# Altium schematic sheet Input.SchDoc: INPUT
size A4
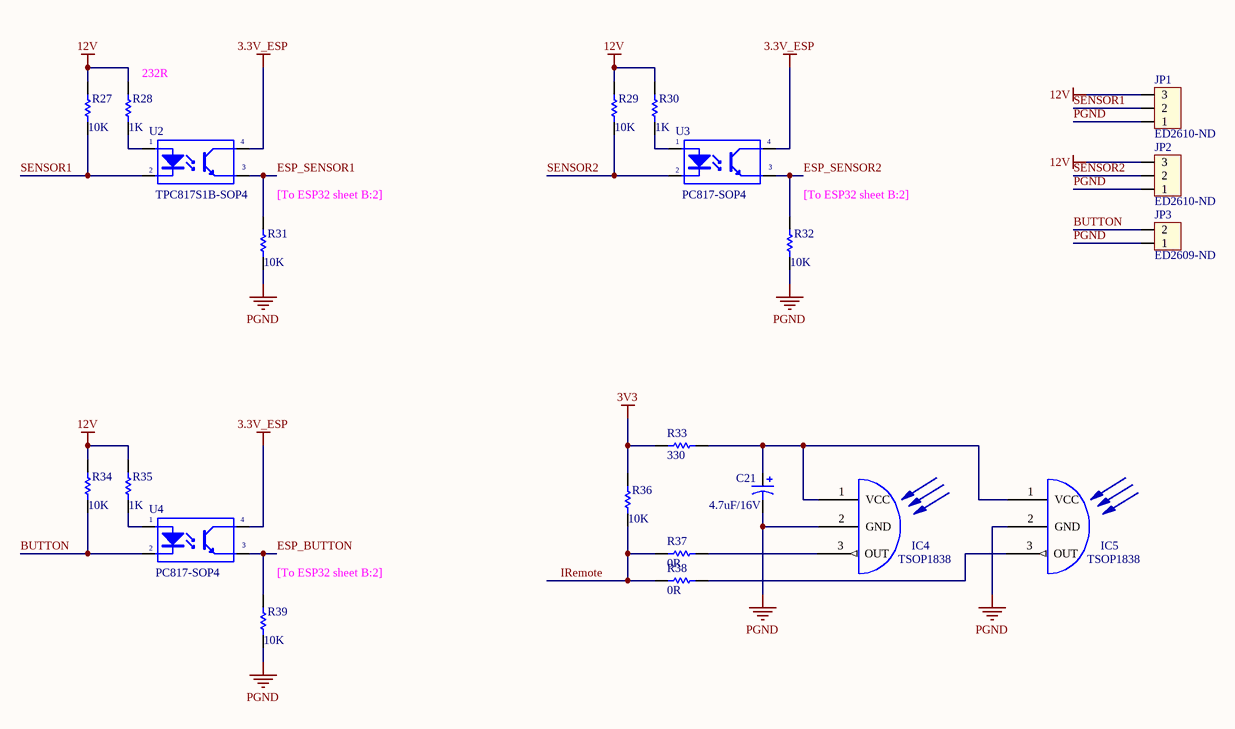
[diagram p0: Input.SchDoc]

## Parts
C21  value 4.7uF/16V  [C0805]  (hidden comment: Cap Pol1)
IC4  TSOP1838  [TSOP1838]
IC5  TSOP1838  [TSOP1838]
JP1  ED2610-ND  [DOMINO_OSTTC_3P]
JP2  ED2610-ND  [DOMINO_OSTTC_3P]
JP3  ED2609-ND  [DOMINO_OSTTC_2P]
R27  10K  [Res 0805 SMD]
R28  1K  [Res 0805 SMD]
R29  10K  [Res 0805 SMD]
R30  1K  [Res 0805 SMD]
R31  10K  [Res 0805 SMD]
R32  10K  [Res 0805 SMD]
R33  330  [Res 0805 SMD]
R34  10K  [Res 0805 SMD]
R35  1K  [Res 0805 SMD]
R36  10K  [Res 0805 SMD]
R37  0R  [Res 0805 SMD]
R38  0R  [Res 0805 SMD]
R39  10K  [Res 0805 SMD]
U2  TPC817S1B-SOP4  [TPC817-4SOP]
U3  PC817-SOP4  [TPC817-4SOP]
U4  PC817-SOP4  [TPC817-4SOP]

## Nets
3.3V_ESP: U2.4(C) U3.4(C) U4.4(C)
3V3: R33.2 R36.2
12V: JP1.3 JP2.3 R27.2 R28.2 R29.2 R30.2 R34.2 R35.2
PGND: C21.2 IC4.2(GND) IC5.2(GND) JP1.1 JP2.1 JP3.1 R31.1 R32.1 R39.1
BUTTON: JP3.2 R34.1 U4.2(K)
ESP_BUTTON: R39.2 U4.3(E)
ESP_SENSOR1: R31.2 U2.3(E)
ESP_SENSOR2: R32.2 U3.3(E)
IRemote: R36.1 R37.2 R38.2
SENSOR1: JP1.2 R27.1 U2.2(K)
SENSOR2: JP2.2 R29.1 U3.2(K)
NetC21_1: C21.1 IC4.1(VCC) IC5.1(VCC) R33.1
NetIC4_3: IC4.3(OUT) R37.1
NetIC5_3: IC5.3(OUT) R38.1
NetR28_1: R28.1 U2.1(A)
NetR30_1: R30.1 U3.1(A)
NetR35_1: R35.1 U4.1(A)

## Notes on the sheet
- (near R28) 232R
- [To ESP32 sheet B:2]
- Title
- Size:
- Date:
- A4
- Number:
- Time:
- Revision:
- Sheet
- of
- File:

## Library data of the parts
C21 = Cap Pol1: Polarized Capacitor (Radial); Published: 8-Jun-2000; LatestRevisionDate: 17-Jul-2002; LatestRevisionNote: Re-released for DXP Platform.; PackageReference: RB7.6-15; Publisher: Altium Limited; PackageDescription: Polarized Capacitor (Radial); 2 Leads
JP1 JP2 = Con3: 3 Position Wire to Board Terminal Block Horizontal with Board 0.200" (5.08mm) Through Hole; Value: Connector 3; Digikey: ED2610-ND
JP3 = Con2: 2 Position Wire to Board Terminal Block Horizontal with Board 0.200" (5.08mm) Through Hole; Value: Connector 2; Digikey: ED2609-ND
R27 R29 R34 = 10K/R0603/1%: RES SMD 10K OHM 1% 1/10W 0603; Manufacturer: Yageo; Manufacturer Part Number: RC0603FR-0710KL; Power (Watts): 0.1W, 1/10W; Temperature Coefficient: ±100ppm/°C; Supplier 1: Digi-Key; RoHS: RoHS Compliant; Category: Resistors; Stock 1: 11440000; Pricing 1: 5000=0.00167, 10000=0.00145, 25000=0.00128, 50000=0.00117, 125000=0.00115 (USD); Packaging: Tape & Reel (TR); Resistance (Ohms): 10k; Tolerance: ±1%; Composition: Thick Film; Features: Moisture Resistant; Operating Temperature: -55°C ~ 155°C; Package / Case: 0603 (1608 Metric); Supplier Device Package: 0603; Size / Dimension: 0.063" L x 0.031" W (1.60mm x 0.80mm); Height: 0.022" (0.55mm); Number of Terminations: 2; ComponentLink1URL: http://www.yageo.com/NewPortal/yageodocoutput?fileName=/pdf/R-Chip/PYu-RC_Group_51_RoHS_L_3.pdf; ComponentLink1Description: http://www.yageo.com/NewPortal/yageodocoutput?fileName=/pdf/R-Chip/PYu-RC_Group_51_RoHS_L_3.pdf; Supplier Part Number 1: 311-10.0KHRTR-ND
R28 R30 R35 = 10K/R0603/1%: 1 kOhms ±1% 0.125W, 1/8W Chip Resistor 0805 (2012 Metric) Automotive AEC-Q200 Thick Film; Resistance (Ohms): 10k; Power (Watts): 0.1W, 1/10W; RoHS: RoHS Compliant; Category: Resistors; Features: Moisture Resistant; Operating Temperature: -55°C ~ 155°C; Package / Case: 0603 (1608 Metric); Supplier Device Package: 0603; Size / Dimension: 0.063" L x 0.031" W (1.60mm x 0.80mm); Height: 0.022" (0.55mm); Number of Terminations: 2; ComponentLink1URL: http://www.yageo.com/NewPortal/yageodocoutput?fileName=/pdf/R-Chip/PYu-RC_Group_51_RoHS_L_3.pdf; ComponentLink1Description: http://www.yageo.com/NewPortal/yageodocoutput?fileName=/pdf/R-Chip/PYu-RC_Group_51_RoHS_L_3.pdf; Digikey: 541-1.00KCCT-ND
R31-R33 R36-R39 = 249K/R0805/1%: RES SMD 249K OHM 1% 1/10W 0805; Manufacturer: Yageo; Manufacturer Part Number: RC0603FR-07249KL; Power (Watts): 0.1W, 1/10W; Temperature Coefficient: ±100ppm/°C; Supplier 1: Digi-Key; RoHS: RoHS Compliant; Category: Resistors; Stock 1: 370515; Pricing 1: 1=0.1, 10=0.015, 100=0.006, 1000=0.00268, 2500=0.00233 (USD); Packaging: Cut Tape (CT); Part Status: Active; Tolerance: ±1%; Composition: Thick Film; Features: Moisture Resistant; Operating Temperature: -55°C ~ 155°C; Package / Case: 0603 (1608 Metric); Supplier Device Package: 0603; Size / Dimension: 0.063" L x 0.032" W (1.60mm x 0.80mm); Height - Seated (Max): 0.022" (0.55mm); Failure Rate: -; ComponentLink1URL: http://www.yageo.com/documents/recent/PYu-RC_Group_51_RoHS_L_8.pdf; ComponentLink1Description: http://www.yageo.com/documents/recent/PYu-RC_Group_51_RoHS_L_8.pdf
U2-U4 = PC817: Optoisolator Transistor Output 5000Vrms 1 Channel 4-SOP; Digikey: TPC817S1BRAGCT-ND
  U3 U4: BuyVN: https://banlinhkien.vn/goods-1134-pc817-el817-sop4-opto.html